# Altium schematic sheet IHM.SchDoc: IHM
size A4; DrawnBy: Assil MAHFOUDI; Revision: V1.0 REV A; SheetNumber: 4; SheetTotal: 6
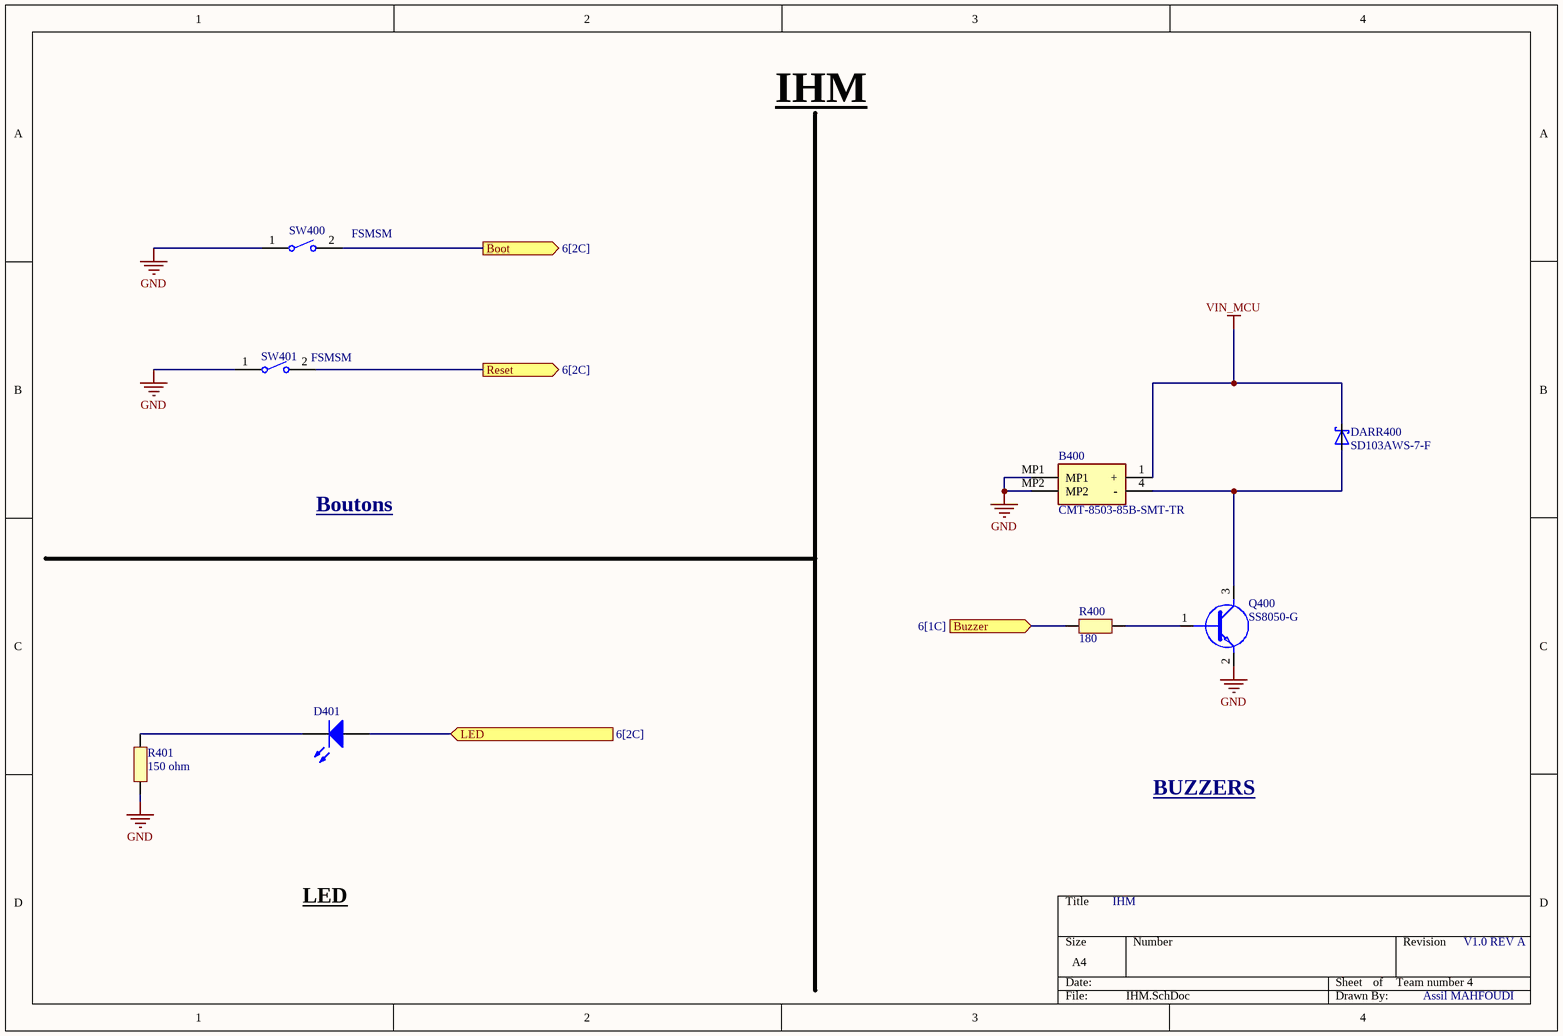
[diagram p0: IHM.SchDoc]

## Parts
B400  CMT-8503-85B-SMT-TR  [CMT850385BSMTTR]
D401  Light-Emitting Diode  (value not drawn)
DARR400  SD103AWS-7-F  [SD103AWS-7-F]
Q400  SS8050-G  [SS8050-G]
R400  180  [RESC1005X06N]
R401  150 ohm  [RESC1005X06N]
SW400  FSMSM  [TECO-FSMSM-2_V]
SW401  FSMSM  [TECO-FSMSM-2_V]

## Ports
Boot (out, see 6[2C]), Buzzer (in, see 6[1C]), LED (in, see 6[2C]), Reset (out, see 6[2C])

## Nets
GND: B400.MP1 B400.MP2 Q400.2(E) R401.1 SW400.1 SW401.1
VIN_MCU: B400.1(+) DARR400.1(C)
Boot: SW400.2 ; port Boot
Buzzer: R400.1 ; port Buzzer
LED: D401.1(A) ; port LED
Reset: SW401.2 ; port Reset
NetB400_4: B400.4(-) DARR400.2(A) Q400.3(C)
NetD401_2: D401.2(K) R401.2
NetQ400_1: Q400.1(B) R400.2

## Notes on the sheet
- IHM
- Boutons <https://docs.rs-online.com/d386/0900766b80fa5b10.pdf>
- BUZZERS <https://eu.mouser.com/datasheet/2/1628/cmt_8503_85b_smt_tr-3509034.pdf>
- LED
- Team number 4

## Library data of the parts
B400 = CMT-8503-85B-SMT-TR: Speakers & Transducers buzzer, 8.5 mm, 3 mm deep, M, 3.6 V, 85 dB, Surface Mount (SMT), Audio Transducer; Manufacturer_Name: Same Sky; Manufacturer_Part_Number: CMT-8503-85B-SMT-TR; Mouser Part Number: 490-CMT-850385BSMTTR
D401 = LED: AF: 1; BV: 0; BV_MAX: 1e99; EG: 1.11; FC: 0.5; IBV: 0.001; IS: 1e-14; MJSW: 0.33; NTUN: 30; TNOM: 27; XTI: 3; SimulationGenericComponent: True; CJO: 0; CJP: 0; CTA: 0; CTP: 0; FCS: 0.5; FV_MAX: 1e99; IKF: 0; IKR: 0; ISR: 1e-14; JSW: 0; JTUN: 0; JTUNSW: 0; KEG: 1; KF: 0; LEVEL: 1; N: 1; NBV: 1; NR: 1; NS: 1; PHP: 1; RS: 0; TCV: 0; TLEV: 0; TLEVC: 0; TM1: 0; TM2: 0; TPB: 0; TPHP: 0; TRS: 0; TRS2: 0; TT: 0; TTT1: 0; TTT2: 0; VJ: 1; XTITUN: 3
DARR400 = SD103AWS-7-F: Diode Array 3 Independent Schottky 40V 175mA Surface Mount 6-TSSOP, SC-88, SOT-363
Q400 = SS8050-G: Bipolar Transistors - BJT NPN TRANSISTOR 1.5A 40V
R400 R401 = Resistor
SW400 SW401 = CMP-2000-07511-1: FSMSM Push Button Switch, 50 mA, -35 to 85 degC, 2-Pin SMD, RoHS, Bulk; Manufacturer: TE Connectivity; Actuator Length: 1.07mm; Electrical Life: 20000Cycles; Actuator Material: Polyamide; Current Rating: 50mA; Illumination Type: Illuminated; Voltage Rating (DC): 24V; Contact Resistance: 100mOhm; Case\/Package: SMD/SMT; Operating Force: 180gf; Switch Travel: 0.25mm; Max Voltage Rating (DC): 12V; Throw Configuration: SPST; Packaging: LoosePiece; Max Operating Temperature: 85degC; ELV: Compliant; Package Description: 2-Pin Surface Mount Device, Body 6 x 3.5 mm, Pitch 9.19 mm; RoHSCompliant: true; Manufacturer URL: http://www.te.com/; Contact Plating: Silver; Contact Material: Brass; Mounting Technology: SurfaceMount; Contact Current Rating: 50mA; Datasheet Version: Rev. C2, 08/2014; Datasheet URL: http://www.te.com/commerce/DocumentDelivery/DDEController?Action=showdoc&DocId=Customer+Drawing%7F1437566-3%7FC2%7Fpdf%7FEnglish%7FENG_CD_1437566-3_C2_1437566_3_1_c.dwg.pdf%7F1437566-3; Mechanical Life: 20000Cycles; Package Reference: FSMSM; REACH SVHC: Unknown; Orientation: Straight; Min Operating Temperature: -35degC; Lead Free: LeadFree; Termination: GullWing; Package Quantity: 1000; Mount: SurfaceMount